# EAGLE design board-alt (EAGLE 8.7.1)
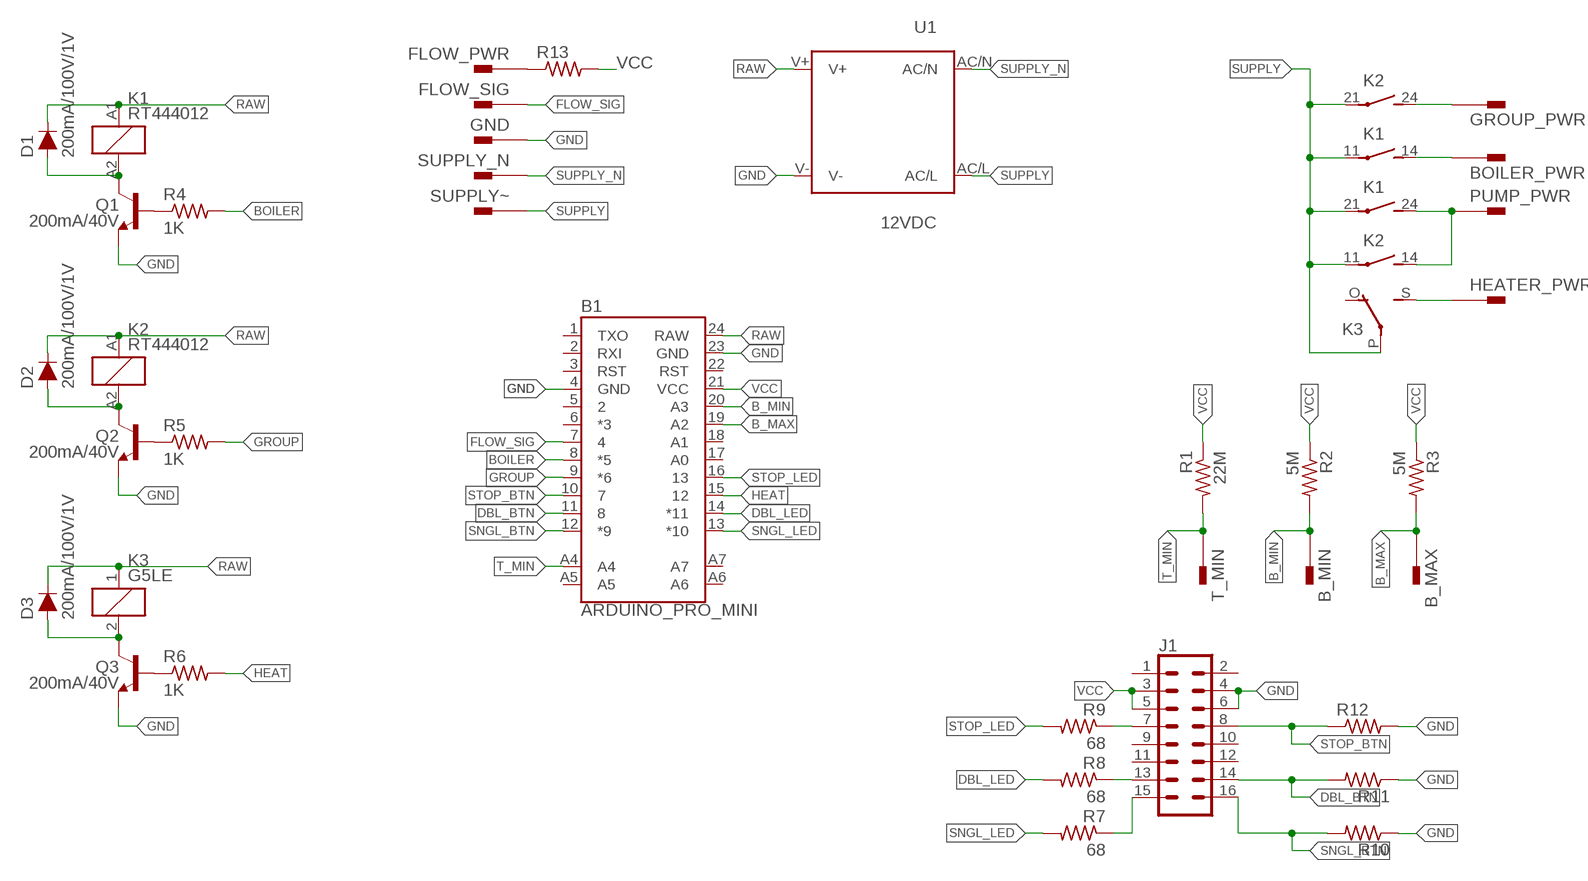
[diagram p0: schematic, sheet 1]

## Parts
B1  ARDUINO_PRO_MINI  [ARDUINO_PRO_MINI]
B_MAX  PIN2F061.040  [F061.040]
B_MIN  PIN2F061.040  [F061.040]
BOILER_PWR  PIN2F061.040  [F061.040]
D1  200mA/100V/1V  DIODE-1N4148  [DIODE-1N4148]
D2  200mA/100V/1V  DIODE-1N4148  [DIODE-1N4148]
D3  200mA/100V/1V  DIODE-1N4148  [DIODE-1N4148]
FLOW_PWR  PIN2F061.040  [F061.040]
FLOW_SIG  PIN2F061.040  [F061.040]
GND  PIN2F061.040  [F061.040]
GROUP_PWR  PIN2F061.040  [F061.040]
HEATER_PWR  PIN2F061.040  [F061.040]
J1  CONN_08X2  [2X8]
K1  RT444012  [RT2N/O]
K2  RT444012  [RT2N/O]
K3  G5LE  [G5LE]
PUMP_PWR  PIN2F061.040  [F061.040]
Q1  200mA/40V  TRANS_NPN-2N3904  [TO-92]
Q2  200mA/40V  TRANS_NPN-2N3904  [TO-92]
Q3  200mA/40V  TRANS_NPN-2N3904  [TO-92]
R1  22M  R-US_0207/7  [0207/7]
R2  5M  R-US_0207/7  [0207/7]
R3  5M  R-US_0207/7  [0207/7]
R4  1K  R-US_0207/7  [0207/7]
R5  1K  R-US_0207/7  [0207/7]
R6  1K  R-US_0207/7  [0207/7]
R7  68  R-US_0207/7  [0207/7]
R8  68  R-US_0207/7  [0207/7]
R9  68  R-US_0207/7  [0207/7]
R10  R-US_0207/7  [0207/7]
R11  R-US_0207/7  [0207/7]
R12  R-US_0207/7  [0207/7]
R13  R-US_0207/7  [0207/7]
SUPPLY_N  PIN2F061.040  [F061.040]
SUPPLY~  PIN2F061.040  [F061.040]
T_MIN  PIN2F061.040  [F061.040]
U1  12VDC  IRM_05/10  [IRM_05/10]

## Nets
B_MAX: B1.19(A2) B_MAX.A1 B_MAX.A2 R3.2
B_MIN: B1.20(A3) B_MIN.A1 B_MIN.A2 R2.2
BOILER: B1.8(*5) R4.2
DBL_BTN: B1.11 J1.14 R11.2
DBL_LED: B1.14(*11) R8.2
FLOW_SIG: B1.7 FLOW_SIG.A1 FLOW_SIG.A2
GND: B1.4(GND) B1.23(GND) GND.A1 GND.A2 J1.4 J1.6 Q1.1(E) Q2.1(E) Q3.1(E) R10.1 R11.1 R12.2 U1.V-
GROUP: B1.9(*6) R5.2
HEAT: B1.15 R6.2
N$2: GROUP_PWR.A1 GROUP_PWR.A2 K2.24(3:S)
N$3: FLOW_PWR.A1 FLOW_PWR.A2 R13.1
N$5: Q1.2(B) R4.1
N$9: Q2.2(B) R5.1
N$10: K1.24(3:S) K2.14(2:S) PUMP_PWR.A1 PUMP_PWR.A2
N$12: HEATER_PWR.A1 HEATER_PWR.A2 K3.S(2:S)
N$13: Q3.2(B) R6.1
N$14: J1.7 R9.1
N$16: D3.A K3.2 Q3.3(C)
N$18: D2.A K2.A2 Q2.3(C)
N$19: BOILER_PWR.A1 BOILER_PWR.A2 K1.14(2:S)
N$20: D1.A K1.A2 Q1.3(C)
N$23: J1.13 R8.1
N$24: J1.15 R7.1
RAW: B1.24(RAW) D1.C D2.C D3.C K1.A1 K2.A1 K3.1 U1.V+
SNGL_BTN: B1.12(*9) J1.16 R10.2
SNGL_LED: B1.13(*10) R7.2
STOP_BTN: B1.10 J1.8 R12.1
STOP_LED: B1.16 R9.2
SUPPLY: K1.11(2:P) K1.21(3:P) K2.11(2:P) K2.21(3:P) K3.P(2:P) SUPPLY~.A1 SUPPLY~.A2 U1.AC/L
SUPPLY_N: SUPPLY_N.A1 SUPPLY_N.A2 U1.AC/N
T_MIN: B1.A4 R1.2 T_MIN.A1 T_MIN.A2
VCC: B1.21(VCC) J1.3 J1.5 R1.1 R2.1 R3.1 R13.2
Unconnected: B1.1(TXO) B1.2(RXI) B1.3(RST) B1.5 B1.6(*3) B1.17(A0) B1.18(A1) B1.22(RST) B1.A5 B1.A6 B1.A7 J1.1 J1.2 J1.9 J1.10 J1.11 J1.12 K3.O(2:O)

## Library data of the parts
B1 = SparkFun-Boards:ARDUINO_PRO_MINI: SparkFun Pro Mini Pro Mini compatible footprint. Dimensions: 0.7 x 1.3" PCB Thickness: 0.8mm SparkFun Products: 3.3V/8MHz <https://www.sparkfun.com/products/11114> 5V/16MHz <https://www.sparkfun.com/products/11113>
B_MAX B_MIN BOILER_PWR FLOW_PWR FLOW_SIG GND GROUP_PWR HEATER_PWR PUMP_PWR SUPPLY_N SUPPLY~ T_MIN = con-faston:PIN2: Flachstecker Typ Tyco/Electronics/AMP TAB, FASTON Printed Circuit Board Tabs Source: http://www.buerklin.com, http://catalog.tycoelectronics.com; OC_FARNELL: unknown; OC_NEWARK: unknown
D1-D3 = SparkFun-DiscreteSemi:DIODE: Diode These are standard reverse protection diodes and small signal diodes. SparkFun Products: SparkFun SparkPunk Sound Kit <https://www.sparkfun.com/products/11177> SparkFun ESP8266 Thing <https://www.sparkfun.com/products/13231>; PROD_ID: DIO-08378
J1 = SparkFun-Connectors:CONN_08X2: Multi connection point. Often used as Generic Header-pin footprint for 0.1 inch spaced/style header connections You can populate with any combo of single row headers, but if you'd like an exact match, check this: Header - 2x8 (Male, 0.1") <https://www.sparkfun.com/products/13156> (PRT-13156) On any of the 0.1 inch spaced packages, you can populate with these: Break Away Headers - Straight <https://www.sparkfun.com/products/116> (PRT-00116) Break Away Male Headers - Right Angle <https://www.sparkfun.com/products/553> (PRT-00553) Female Headers <https://www.sparkfun.com/products/115> (PRT-00115) Break Away Headers - Machine Pin <https://www.sparkfun.com/products/117> (PRT-00117) Break Away Female Headers - Swiss Machine Pin <https://www.sparkfun.com/products/743> (PRT-00743)
K1 K2 = relay:RT44?*: Power PCB Relay SCHRACK 2 pole 8 A, DC and AC-coil Source: http://www.schrack.com/.. 5842.pdf; OC_FARNELL: unknown; OC_NEWARK: unknown
K3 = relay:G5LE: RELAY 1 x switch, 10 A/120 V AC, 8 A/30 V DC, Omron; OC_FARNELL: unknown; OC_NEWARK: unknown
Q1-Q3 = SparkFun-DiscreteSemi:TRANS_NPN: NPN transistor Current controlled devices typically used to amplify current or used as a switch. BC547 - COM-08928 <http://www.sparkfun.com/products/8928> (TO-92 45V 100mA) (1.Collector 2.Base 3.Emitter) 2N3904 - COM-00521 <http://www.sparkfun.com/products/521> (TO-92 40V 200mA) (1.Emitter 2.Base 3.Collector) P2N2222A - COM-12852 <http://www.sparkfun.com/products/12852> (TO-92 40V 600mA) (1.Collector 2.Base 3.Emitter); PROD_ID: TRANS-08447
R1-R13 = rcl:R-US_: RESISTOR, American symbol; SPICEPREFIX: R
U1 = meanwell_irm_v5:IRM_05/10: 5 or 10 watt housing & pin compatible IRM 05 Vout [V] Imax [A] Pmax [W] Eff [%] 3.3 1.25 4.125 68 5 1 5 71 12 0.42 5.04 75 15 0.33 4.95 75 24 0.23 5.52 77 IRM 10 Vout [V] Imax [A] Pmax [W] Eff [%] 3.3 2.5 8.25 74 5 2 10 77 12 0.85 10.2 82 15 0.67 10.05 82 24 0.42 10.08 82

## Board
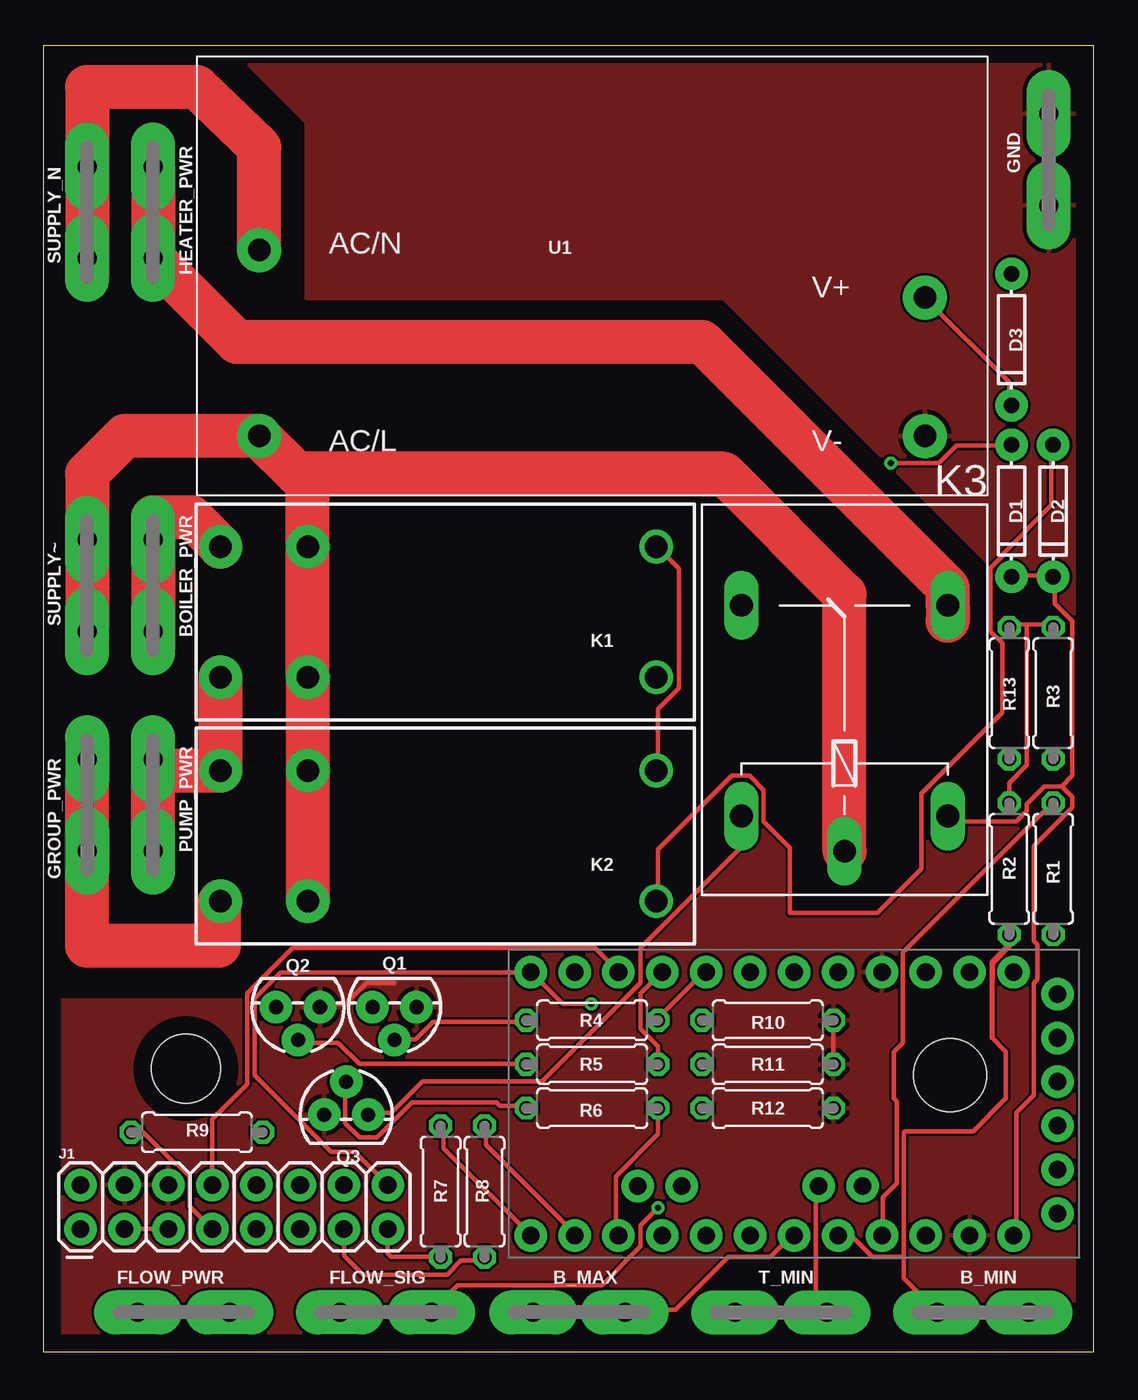
[diagram p1: board, top side]
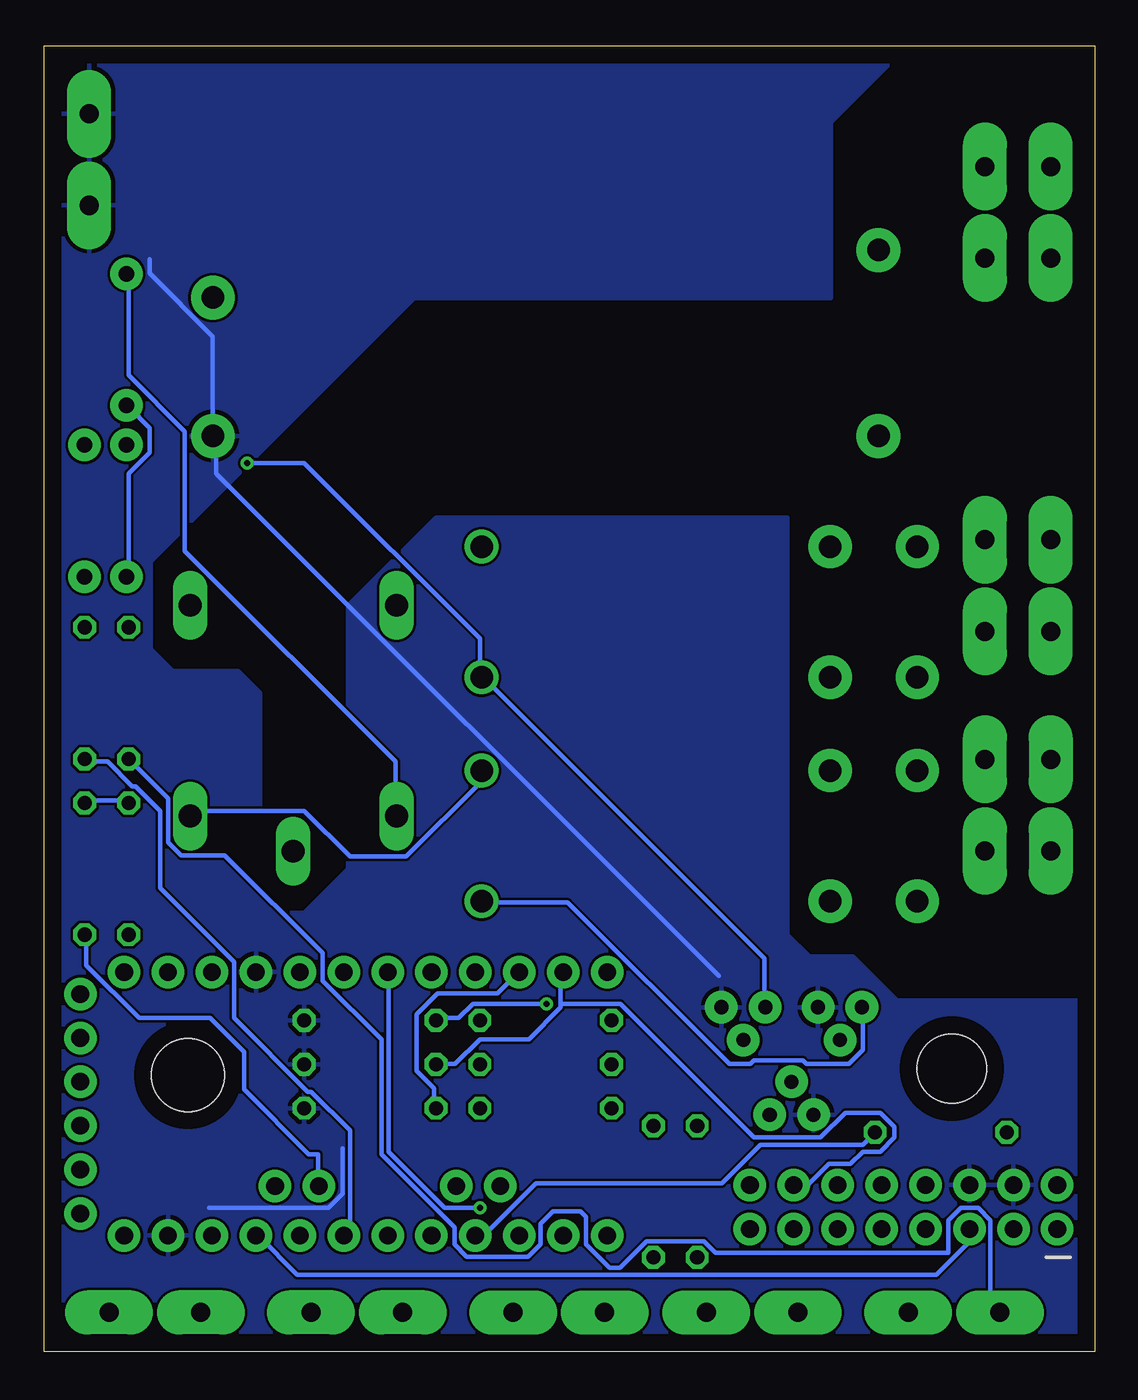
[diagram p2: board, bottom side, seen from below]

Size 60.76 x 75.56 mm. Coordinates in mm from the lower left corner, seen from the top.
Outline: 0,0 60.76,0 60.76,75.56 0,75.56 0,0
Copper layers (1*16): Top 0.035mm / dielectric 1.5mm / Bottom 0.035mm
Design rules "default *": minimum track width 10mil, minimum drill 0.35mm, track to track 6mil, track to pad 6mil, pad to pad 6mil, via to via 6mil, smd to smd 6mil, copper to edge 40mil, drill to drill 6mil, minimum pad ring 10mil, minimum via ring 8mil, stop-mask expansion 4mil, vias tented up to drill 0mil, thermal gap 10mil
Holes 4.2 mm at 52.45,16
Holes 4 mm at 8.26,16.38

### Footprints (pad centres in the part's own frame; a part is rotated, then mirrored left to right if it is on the bottom)
ARDUINO_PRO_MINI = drill 1.016 pad 1.88: 1 -7.62,12.7; 2 -7.62,10.16; 3 -7.62,7.62; 4 -7.62,5.08; 5 -7.62,2.54; 6 -7.62,0; 7 -7.62,-2.54; 8 -7.62,-5.08; 9 -7.62,-7.62; 10 -7.62,-10.16; 11 -7.62,-12.7; 12 -7.62,-15.24; 13 7.62,-15.24; 14 7.62,-12.7; 15 7.62,-10.16; 16 7.62,-7.62; 17 7.62,-5.08; 18 7.62,-2.54; 19 7.62,0; 20 7.62,2.54; 21 7.62,5.08; 22 7.62,7.62; 23 7.62,10.16; 24 7.62,12.7; A4 4.763,1.429; A5 4.763,3.969; A6 4.763,-9.049; A7 4.763,-6.509; BLK -6.35,15.24; GND -3.81,15.24; GRN 6.35,15.24; RXI 1.27,15.24; TXO 3.81,15.24; VCC -1.27,15.24
F061.040 = drill 1.1 pad 2.54 long: A1 -2.65,0; A2 2.65,0
DIODE-1N4148 = drill 0.9 pad 1.88: A -3.81,0; C 3.81,0
2X8 = drill 1.016 pad 1.88: 1 0,0; 2 0,2.54; 3 2.54,0; 4 2.54,2.54; 5 5.08,0; 6 5.08,2.54; 7 7.62,0; 8 7.62,2.54; 9 10.16,0; 10 10.16,2.54; 11 12.7,0; 12 12.7,2.54; 13 15.24,0; 14 15.24,2.54; 15 17.78,0; 16 17.78,2.54
RT2N/O = drill 1.3 pad 2.5: 11 7.56,-3.78; 14 12.6,-3.78; 21 7.56,3.78; 24 12.6,3.78 | drill 1.3: A1 -12.6,-3.78; A2 -12.6,3.78
G5LE = drill 1.321 long: 1 -7.493,-5.969; 2 -7.493,5.969; O 4.699,5.969; P -9.525,0; S 4.699,-5.969
TO-92 = drill 0.813 pad 1.88: 1 -1.27,0; 2 0,1.905; 3 1.27,0
0207/7 = drill 0.813 octagon: 1 -3.81,0; 2 3.81,0
IRM_05/10 = drill 1.3 pad 2.54: AC/L -19.25,-9.25; AC/N -19.25,1.5; V+ 19.25,-1.25; V- 19.25,-9.25

### Placement (x,y rotation side)
B1  43.43,14.35 270 top
B_MAX  30.99,2.29 180 top
B_MIN  54.36,2.29 0 top
BOILER_PWR  6.35,44.32 90 top
D1  56.01,48.64 270 top
D2  58.42,48.64 270 top
D3  56.01,58.55 270 top
FLOW_PWR  8.13,2.29 180 top
FLOW_SIG  19.81,2.29 180 top
GND  58.17,68.96 90 top
GROUP_PWR  2.54,31.62 270 top
HEATER_PWR  6.35,65.91 90 top
J1  2.16,7.11 0 top
K1  22.86,42.8 180 top
K2  22.86,29.84 180 top
K3  46.35,38.48 90 top
PUMP_PWR  6.35,31.62 90 top
Q1  20.32,19.94 180 top
Q2  14.73,19.94 180 top
Q3  17.53,13.72 0 top
R1  58.42,27.94 270 top
R2  55.88,27.94 270 top
R3  58.42,38.1 270 top
R4  31.75,19.18 0 top
R5  31.75,16.64 0 top
R6  31.75,14.1 0 top
R7  22.99,9.27 90 top
R8  25.53,9.27 90 top
R9  8.89,12.7 0 top
R10  41.91,19.18 180 top
R11  41.91,16.64 180 top
R12  41.91,14.1 0 top
R13  55.88,38.1 90 top
SUPPLY_N  2.54,65.91 90 top
SUPPLY~  2.54,44.32 90 top
T_MIN  42.67,2.29 0 top
U1  31.75,62.23 0 top

### Tracks (layer width: path | path; a pad name or v marks a point on that pad's centre or on a via)
B_MAX
  Top 0.254: B_MAX.A2 28.45,2.44 33.53,2.44 B_MAX.A1 33.73,2.44 36.58,2.44 39.62,5.49 42.06,5.49 43.28,6.71 B1.19
  Bottom 0.254: R3.2 58.32,34.14 57.1,34.14 55.68,32.72 55.47,32.72 54.05,31.29 54.05,26.82 49.78,22.55 49.78,19.3 45.52,15.04 45.31,15.04 43.08,12.8 43.08,7.11 43.28,6.91 B1.19
B_MIN
  Top 0.254: B_MIN.A2 B_MIN.A1 51.61,2.44 49.78,4.27 49.78,5.49 | 54.89,22.58 54.86,22.55 54.86,18.18 54.89,18.15 | 54.89,22.58 55.88,23.57 R2.2 55.88,23.44 54.91,22.48 54.91,21.61 54.89,21.59 | 49.78,5.49 49.78,12.7 49.84,12.76 53.79,12.76 55.69,14.66 55.69,17.34 54.89,18.15 | 49.78,5.49 47.95,5.49 46.74,6.71 46.13,6.71 B1.20 | 54.89,22.58 54.89,21.59 | 54.89,21.59 54.89,18.15
BOILER
  Top 0.254: R4.2 35.56,19.3 38.2,21.95 B1.8
DBL_BTN
  Bottom 0.254: 30.89,20.12 30.89,21.95 B1.11 | 30.89,20.12 30.89,19.91 32.72,18.09 35.56,18.09 36.98,16.66 38,16.66 R11.2 | 30.89,20.12 27.43,20.12 19.71,12.39 15.85,12.39 14.43,13.82 12.39,13.82 11.58,13.01 11.58,12.39 12.39,11.58 13.41,11.58 14.12,10.87 15.36,10.87 16.58,9.65 J1.14
DBL_LED
  Top 0.254: R8.2 25.6,13.01 25.6,11.99 30.68,6.91 B1.14
FLOW_SIG  (via drill 0.35)
  Top 0.254: v35.56,8.33 34.54,7.32 34.54,6.1 32.31,3.86 23.98,3.86 22.55,2.44 FLOW_SIG.A1 22.35,2.44 17.27,2.44 FLOW_SIG.A2
  Bottom 0.254: v35.56,8.33 37.59,8.33 40.84,11.58 40.84,21.95 B1.7
GND
  Top 0.254: GND.A2 58.32,71.93 58.32,66.85 GND.A1 | R11.1 R10.1 45.72,19.3 | 48.36,21.95 B1.4 | 20.32,21.34 18.69,21.34 17.48,20.12 16.05,20.12 Q2.1
  Bottom 0.254: 54.66,63.2 54.66,62.38 51,58.73 51,53.03 U1.V- 50.8,52.83 50.8,50.8 21.74,21.74 | 58.12,66.65 GND.A1 | 51.21,8.33 44.3,8.33 43.48,9.14 43.48,11.79 | 53.44,6.91 B1.23 | 45.72,14.02 R12.2 | 15.85,20.12 Q2.1
  pour Top: 10.16,76.2 15.24,71.12 15.24,60.96 39.37,60.96 54.61,45.72 54.61,39.37 49.53,39.37 49.53,27.94 46.99,25.4 45.72,25.4 43.18,27.94 43.18,41.91 43.18,43.18 38.1,48.26 17.78,48.26 17.78,22.86 13.97,22.86 11.43,20.32 0,20.32 0,0 60.96,0 60.96,76.2
  pour Bottom: 11.43,74.93 15.24,71.12 15.24,60.96 39.37,60.96 54.61,45.72 54.61,40.64 53.34,39.37 50.8,39.37 49.53,39.37 48.26,38.1 48.26,26.67 46.99,25.4 45.72,25.4 43.18,27.94 43.18,43.18 38.1,48.26 17.78,48.26 17.78,24.13 16.51,22.86 13.97,22.86 11.43,20.32 0,20.32 0,0 60.96,0 60.96,76.2 11.43,76.2
GROUP
  Top 0.254: R5.2 35.56,17.68 34.54,18.69 34.54,20.73 35.76,21.95 B1.9
HEAT
  Top 0.254: R6.2 35.56,12.6 33.12,10.16 33.12,6.91 B1.15
N$2
  Top 0.254: GROUP_PWR.A2 2.64,29.06 2.54,29.06 | 2.54,33.02 2.64,34.14 GROUP_PWR.A1
  Top 2.54: K2.24 10.16,25.96 10.16,23.5 2.54,23.5 GROUP_PWR.A2 2.54,29.06 2.54,33.02
N$3
  Top 0.254: FLOW_PWR.A2 FLOW_PWR.A1
  Bottom 0.254: R13.1 53.59,32 53.59,29.47 52.85,28.73 50.32,28.73 44.65,23.06 44.65,21.47 41.25,18.06 41.25,11.41 37.03,7.2 37.03,6.23 36.32,5.51 32.77,5.51 32.05,6.23 32.05,7.41 31.32,8.14 29.73,8.14 29.41,7.82 29.41,6.23 28.06,4.88 27.44,4.88 25.92,6.4 22.6,6.4 21.93,5.73 8.46,5.73 8.46,7.62 7.74,8.33 6.73,8.33 6.02,7.62 6.02,2.83 FLOW_PWR.A2
N$5
  Top 0.254: R4.1 27.84,19.1 22.55,19.1 21.54,18.09 20.32,18.09 Q1.2
N$9
  Top 0.254: R5.1 27.84,16.66 18.29,16.66 17.07,17.88 14.83,17.88 Q2.2
N$10
  Top 0.254: PUMP_PWR.A2 6.5,34.34 6.96,33.62
  Top 2.54: PUMP_PWR.A1 6.35,33.02 6.96,33.62 K2.14 K1.24
N$12
  Top 0.254: HEATER_PWR.A2 6.5,68.48 6.5,64.41 HEATER_PWR.A1
  Top 2.54: HEATER_PWR.A1 11.19,58.42 38.1,58.42 52.32,44.2 K3.S 52.32,42.29 | HEATER_PWR.A2 6.35,62.23
N$13
  Top 0.254: R6.1 27.84,14.22 26.42,14.22 26.21,14.43 21.34,14.43 19.3,12.39 18.29,12.39 17.48,13.21 17.48,15.44 Q3.2
N$14
  Top 0.254: J1.7 8.46,8.43 8.46,10.16 7.74,10.87 7.62,10.87 5.79,12.7 R9.1
N$16
  Top 0.254: Q3.3 18.9,13.82 20.12,13.82 21.95,15.65 28.85,15.65 34.54,21.34 34.54,23.37 40.23,29.06 40.23,30.89 K3.2
  Bottom 0.254: D3.A 55.88,62.18 55.88,56.49 52.63,53.24 52.63,46.33 40.44,34.14 40.44,31.09 K3.2
N$18
  Top 0.254: D2.A 58.32,52.43 58.32,48.97 55.47,46.13 55.47,46.02 54.79,45.34 54.79,41.67 55.47,40.99 55.47,36.98 50.8,32.31 50.8,27.94 48.26,25.4 43.18,25.4 43.18,29.16 41.66,30.68 41.66,32.51 40.84,33.33 39.83,33.33 35.56,29.06 35.56,26.21 K2.A2
  Bottom 0.254: Q2.3 13.41,19.91 13.41,17.48 14.22,16.66 16.66,16.66 16.87,16.87 19.71,16.87 19.91,16.66 21.13,16.66 30.48,26.01 35.36,26.01 K2.A2
N$19
  Top 0.254: BOILER_PWR.A1 6.5,41.66 6.35,41.66 | BOILER_PWR.A2 6.5,47.14 6.5,48.26
  Top 2.54: K1.14 8.58,48.26 6.5,48.26 6.35,48.26 | BOILER_PWR.A2 BOILER_PWR.A1 6.35,41.66 6.35,40.64
N$20  (via drill 0.35)
  Top 0.254: v49.02,51.41 51.82,51.41 52.83,52.43 55.88,52.43 D1.A
  Bottom 0.254: Q1.3 19.1,20.12 19.1,22.76 35.36,39.01 K1.A2 35.56,39.22 35.56,41.25 45.72,51.41 v49.02,51.41
N$23
  Top 0.254: R8.1 25.4,5.28 24.18,5.28 23.37,4.47 18.49,4.47 17.4,5.56 J1.13
N$24
  Top 0.254: R7.1 22.96,5.49 20.12,5.49 19.91,5.69 J1.15
RAW
  Top 0.254: D1.C 56.08,44.91 58.32,44.91 D2.C 58.52,44.7 58.52,43.28 59.54,42.27 59.54,33.33 58.93,32.72 | D3.C 55.88,54.86 55.88,56.08 51,60.96 U1.V+ | K2.A1 35.56,33.73 35.56,37.19 36.78,38.41 36.78,45.31 35.56,46.53 K1.A1 | 58.93,32.72 59.54,32.11 59.54,31.5 57.3,29.26 57.3,23.77 57.51,23.57 57.51,21.54 57.3,21.34 57.3,14.83 56.29,13.82 56.29,6.91 B1.24 | 58.93,32.72 57.91,32.72 56.9,31.7 56.9,31.29 56.29,30.68 52.63,30.68 K3.1
  Bottom 0.254: D1.C 55.88,44.91 55.88,50.8 54.66,52.02 54.66,53.44 55.88,54.66 D3.C | K3.1 52.02,31.29 45.72,31.29 43.08,28.65 39.83,28.65 35.56,32.92 35.56,33.53 K2.A1
SNGL_BTN  (via drill 0.35)
  Top 0.254: v31.7,20.12 30.07,20.12 28.25,21.95 B1.12 28.04,21.95 13.74,21.95 12.24,20.44 12.24,16 16.66,11.58 18.01,11.58 J1.16
  Bottom 0.254: v31.7,20.12 35.97,20.12 36.78,19.3 38,19.3 R10.2
SNGL_LED
  Top 0.254: R7.2 23.16,13.01 23.16,11.79 28.04,6.91 B1.13
STOP_BTN
  Top 0.254: B1.10 33.12,22.15 31.9,23.37 14.43,23.37 11.79,20.73 11.79,15.47 9.78,13.46 J1.8
  Bottom 0.254: R12.1 38.2,14.22 38.2,15.24 39.22,16.26 39.22,19.51 38,20.73 34.54,20.73 33.33,21.95 B1.10
STOP_LED
  Bottom 0.254: B1.16 35.33,6.73 32.31,9.75 21.56,9.75 19.33,11.99 13.41,11.99 R9.2
SUPPLY
  Top 0.254: SUPPLY~.A1 2.64,41.66 2.54,41.91
  Top 2.54: 14.68,50.8 15.3,50.18 K1.11 K1.21 K2.11 K2.21 | 2.54,41.91 SUPPLY~.A2 2.54,50.8 4.72,52.98 U1.AC/L 14.68,50.8 | K3.P 46.35,43.81 39.37,50.8 14.68,50.8
SUPPLY_N
  Top 0.254: 2.54,63.4 2.64,63.4 SUPPLY_N.A1 2.54,73.15
  Top 2.54: 2.54,62.23 SUPPLY_N.A1 2.54,63.4 SUPPLY_N.A2 2.54,73.15 8.89,73.15 12.5,69.67 U1.AC/N
T_MIN
  Top 0.254: 45.31,2.44 44.7,2.44 | 44.7,2.44 40.03,2.44 T_MIN.A1 | 45.31,2.44 T_MIN.A2 | 44.7,2.44 44.7,9.55 B1.A4 | 44.7,2.44 T_MIN.A2 | T_MIN.A1 45.16,2.29 | 45.16,2.29 45.31,2.44 | T_MIN.A2 45.16,2.29 | T_MIN.A1 T_MIN.A2
  Bottom 0.254: R1.2 58.32,23.98 58.32,22.35 55.27,19.3 51.17,19.3 49.21,17.34 49.21,15.17 45.47,11.43 44.91,11.43 44.91,9.75 B1.A4
VCC
  Top 0.254: 56.9,42.06 58.32,42.06 R3.1 | 56.9,42.06 55.88,42.06 R13.2 | R2.1 55.88,32.92 56.9,33.93 56.9,42.06 | B1.21 48.56,6.91 48.56,8.94 49.38,9.75 49.38,14.49 49.21,14.66 49.21,17.34 49.73,17.87 49.73,23.11 58.32,31.7 R1.1 | J1.3 J1.5
  Bottom 0.254: R2.1 55.88,31.9 58.32,31.9 R1.1 | B1.21 48.36,6.71 46.13,4.47 9.14,4.47 7.24,6.38 J1.5